# EAGLE schematic Analog_Master (EAGLE 7.4.0)
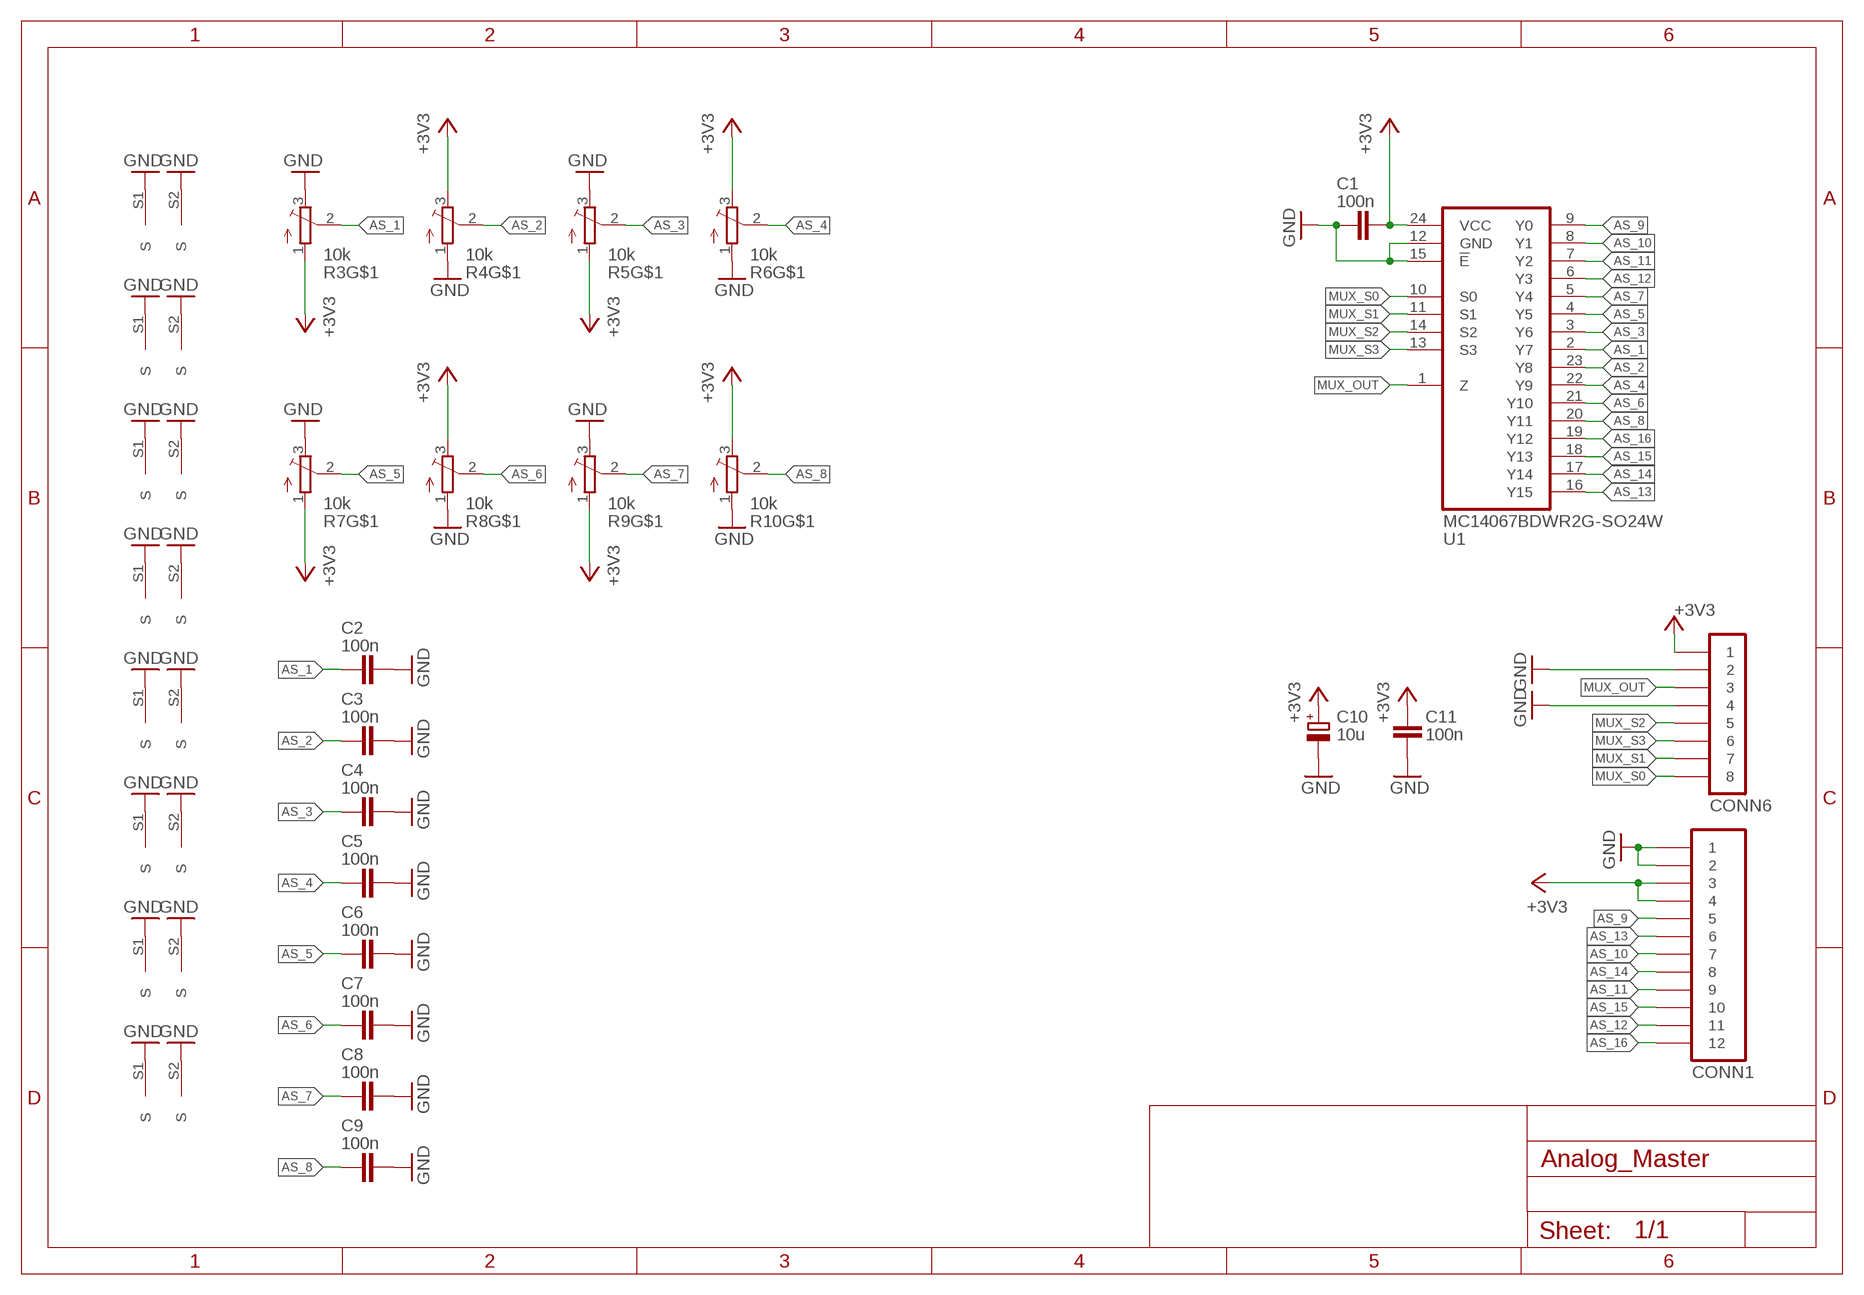
[diagram p0: schematic, sheet 1]

## Parts
C1  100n  CAPACITOR-0805  [C0805]
C2  100n  CAPACITOR-0805  [C0805]
C3  100n  CAPACITOR-0805  [C0805]
C4  100n  CAPACITOR-0805  [C0805]
C5  100n  CAPACITOR-0805  [C0805]
C6  100n  CAPACITOR-0805  [C0805]
C7  100n  CAPACITOR-0805  [C0805]
C8  100n  CAPACITOR-0805  [C0805]
C9  100n  CAPACITOR-0805  [C0805]
C10  10u  ELECTROLYTIC_CAPACITOR16V-CLV-0405  [153CLV-0405]
C11  100n  CAPACITOR-0805  [C0805]
CONN1  PINHD-2X06-IDC-2.54-V  [IDC-12P-2.54]
CONN6  PINHD-2X04-IDC-2.54-V  [IDC-08P-2.54]
R3  10k  PTV09A-4025F-B103  [PTV09A-4025F-B103]
R4  10k  PTV09A-4025F-B103  [PTV09A-4025F-B103]
R5  10k  PTV09A-4025F-B103  [PTV09A-4025F-B103]
R6  10k  PTV09A-4025F-B103  [PTV09A-4025F-B103]
R7  10k  PTV09A-4025F-B103  [PTV09A-4025F-B103]
R8  10k  PTV09A-4025F-B103  [PTV09A-4025F-B103]
R9  10k  PTV09A-4025F-B103  [PTV09A-4025F-B103]
R10  10k  PTV09A-4025F-B103  [PTV09A-4025F-B103]
U1  MC14067BDWR2G-SO24W  [SO24-W]

## Nets
+3V3: C1.2 C10.+ C11.1 CONN1.3 CONN1.4 CONN6.1 R3.1 R4.3 R5.1 R6.3 R7.1 R8.3 R9.1 R10.3 U1.24(VCC)
AS_1: C2.1 R3.2 U1.2(Y7)
AS_2: C3.1 R4.2 U1.23(Y8)
AS_3: C4.1 R5.2 U1.3(Y6)
AS_4: C5.1 R6.2 U1.22(Y9)
AS_5: C6.1 R7.2 U1.4(Y5)
AS_6: C7.1 R8.2 U1.21(Y10)
AS_7: C8.1 R9.2 U1.5(Y4)
AS_8: C9.1 R10.2 U1.20(Y11)
AS_9: CONN1.5 U1.9(Y0)
AS_10: CONN1.7 U1.8(Y1)
AS_11: CONN1.9 U1.7(Y2)
AS_12: CONN1.11 U1.6(Y3)
AS_13: CONN1.6 U1.16(Y15)
AS_14: CONN1.8 U1.17(Y14)
AS_15: CONN1.10 U1.18(Y13)
AS_16: CONN1.12 U1.19(Y12)
GND: C1.1 C2.2 C3.2 C4.2 C5.2 C6.2 C7.2 C8.2 C9.2 C10.- C11.2 CONN1.1 CONN1.2 CONN6.2 CONN6.4 R3.3 R3.S1(S) R3.S2(S) R4.1 R4.S1(S) R4.S2(S) R5.3 R5.S1(S) R5.S2(S) R6.1 R6.S1(S) R6.S2(S) R7.3 R7.S1(S) R7.S2(S) R8.1 R8.S1(S) R8.S2(S) R9.3 R9.S1(S) R9.S2(S) R10.1 R10.S1(S) R10.S2(S) U1.12(GND) U1.15(!E)
MUX_OUT: CONN6.3 U1.1(Z)
MUX_S0: CONN6.8 U1.10(S0)
MUX_S1: CONN6.7 U1.11(S1)
MUX_S2: CONN6.5 U1.14(S2)
MUX_S3: CONN6.6 U1.13(S3)

## Library data of the parts
C1-C9 C11 = igor_lbr:CAPACITOR: Capacitor
C10 = igor_lbr:ELECTROLYTIC_CAPACITOR: Electrolytic capacitor; MANUFACTURER: Multicomp; MPN: MCVVT016M100CA1L
CONN1 = igor_lbr:PINHD-2X06: Pin Header
CONN6 = igor_lbr:PINHD-2X04: Pin Header
R3-R10 = igor_lbr:PTV09A-4025F-B103: Potentiometer
U1 = igor_lbr:MC14067BDWR2G: 16-Channel Analog Multiplexer/Demultiplexer; MANUFACTURER: ON Semiconductor; MPN: MC14067BDWR2G